# EAGLE design Mini-B-FFC (EAGLE 5.10)
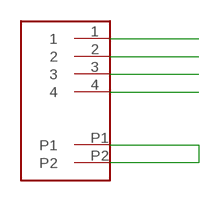
[diagram p0: schematic, sheet 1]

## Parts
U$1  XF2L-0425-1A  [XF2L-0425-1A]

## Nets
1: U$1.1
2: U$1.2
3: U$1.3
GND: U$1.4 U$1.P1 U$1.P2

## Library data of the parts
U$1 = XF2L-0425-1A:XF2L-0425-1A

## Board
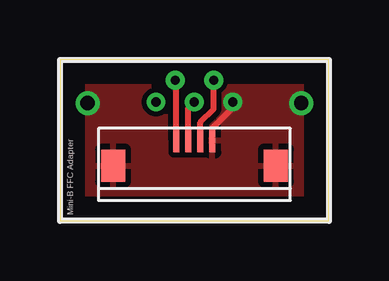
[diagram p1: board, top side]

Size 11.2 x 6.7 mm. Coordinates in mm from the lower left corner, seen from the top.
Outline: 0,6.7 0,0 11.2,0 11.2,6.7 0,6.7
Copper layers (1*16): Top 0.035mm / dielectric 1.5mm / Bottom 0.035mm
Design rules "default": minimum track width 10mil, minimum drill 24mil, track to track 8mil, track to pad 8mil, pad to pad 8mil, via to via 8mil, smd to smd 8mil, copper to edge 40mil, drill to drill 8mil, minimum pad ring 10mil, minimum via ring 8mil, stop-mask expansion 4mil, vias tented up to drill 0mil, thermal gap 10mil

### Footprints (pad centres in the part's own frame; a part is rotated, then mirrored left to right if it is on the bottom)
XF2L-0425-1A = smd 0.25 x 1: 1 -0.75,0.5; 2 -0.25,0.5; 3 0.25,0.5; 4 0.75,0.5 | smd 1 x 1.34: P1 -3.39,-0.55; P2 3.39,-0.55

### Placement (x,y rotation side)
U$1  5.6,2.85 0 top

### Tracks (layer width: path | path; a pad name or v marks a point on that pad's centre or on a via)
1  (via drill 0.38)
  Top 0.254: v4.8,5.85 4.85,5.8 U$1.1
2  (via drill 0.38)
  Top 0.254: v5.6,4.95 5.35,4.7 U$1.2
3  (via drill 0.38)
  Top 0.254: v6.4,5.85 6.4,4.65 5.85,4.1 U$1.3
GND  (via drill 0.38, 0.6)
  Top 0.254: v7.2,4.95 7.2,4.7 6.35,3.85 U$1.4
  other vias: 1.15,4.9 10.05,4.9
  pour Top: -0.35,7 -0.35,-0.55 12.65,-0.55 12.65,7
N$13  (via drill 0.38)
  other vias: 4,4.95

### Text on the board
tPlace: Mini-B FFC Adapter